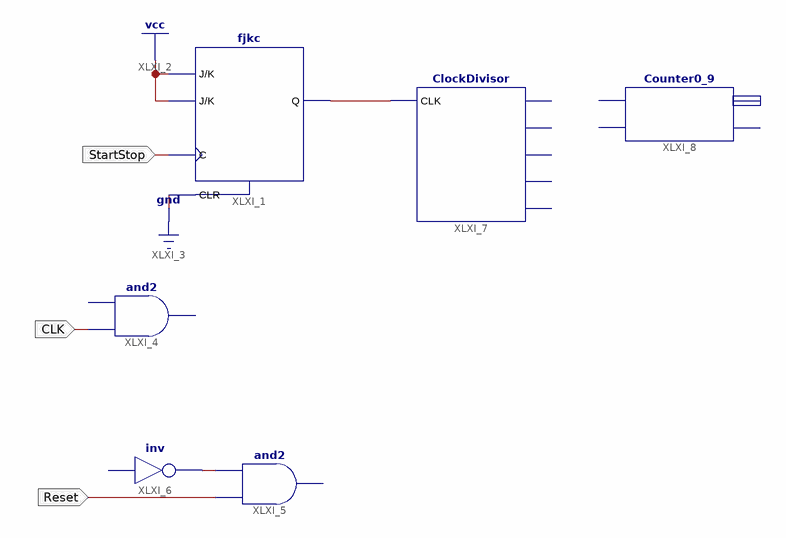
[diagram p0: schematic sheet 1]
// Xilinx ISE schematic Main.sch (spartan6) as structural Verilog: 6 symbols, 3 ports
module Main (
  input  StartStop,
  input  CLK,
  input  Reset
);

  wire XLXN_4, XLXN_7;

  fjkc XLXI_1 (.C(StartStop), .CLR(1'b0), .J(1'b1), .K(1'b1), .Q(XLXN_7));
  // and2 XLXI_4 has open pins: I0=CLK, I1=open, O=open
  // and2 XLXI_5 has open pins: I0=Reset, I1=XLXN_4, O=open
  // inv XLXI_6 has open pins: I=open, O=XLXN_4
  ClockDivisor XLXI_7 (.CLK(XLXN_7));  // open: CLK_2Hz, CLK_1Hz, CLK_10Hz, CLK_100Hz, CLK_1000Hz
  Counter0_9 XLXI_8 ();  // open: Carry, CLK, Q, Reset
endmodule
